# Altium schematic sheet OpenTag3_Sensors.SchDoc
size A
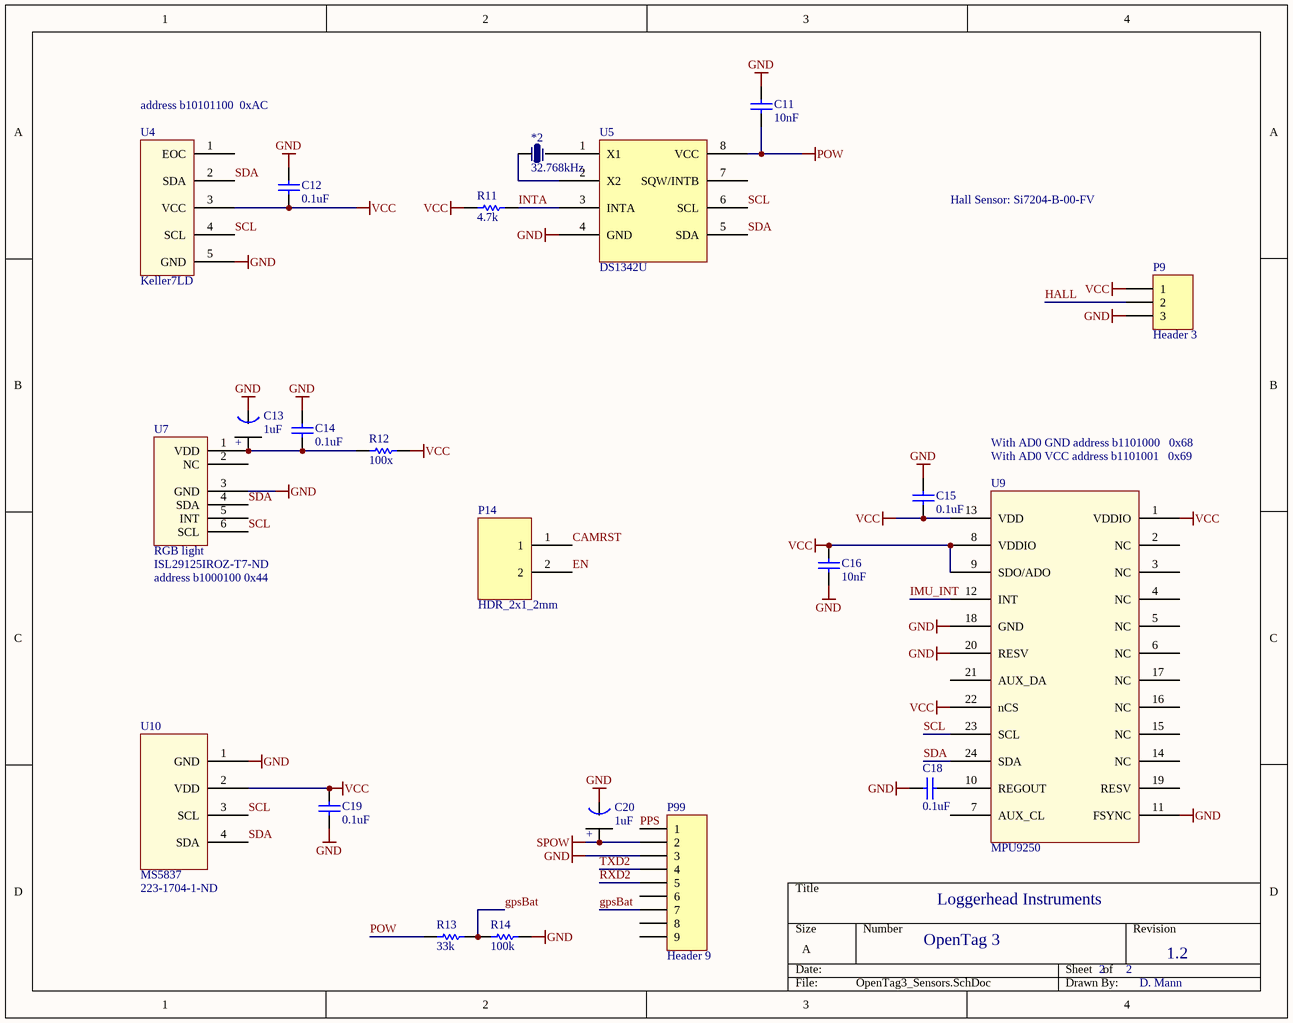
[diagram p0: OpenTag3_Sensors.SchDoc]

## Parts
*2  32.768kHz  [XTAL-ABS06]
C11  10nF  [0402]
C12  0.1uF  [0402]
C13  1uF  [Tant0805]
C14  0.1uF  [0402]
C15  0.1uF  [0402]
C16  10nF  [0402]
C18  0.1uF  [0402]
C19  0.1uF  [0402]
C20  1uF  [Tant0805]
P9  Header 3  [HDR1X3]
P14  HDR_2x1_2mm  [HDR_2x1_2mm]
P99  Header 9  [HDR1X9]
R11  4.7k  [3-0603]
R12  100x  [3-0603]
R13  33k  [3-0603]
R14  100k  [3-0603]
U4  Keller7LD  [Keller7LD]
U5  DS1342U  [uSOP8]
U7  RGB light  Supplier Part Number 1: ISL29125IROZ-T7-ND  [ODFN]
U9  MPU9250  [MPU6500]
U10  MS5837  Supplier Part Number 1: 223-1704-1-ND  [MS5837]

## Nets
GND: C11.1 C12.2 C13.1(GND) C14.2 C15.2 C16.2 C18.1 C19.1 C20.1(GND) P9.3 P99.3 R14.1 U4.5(GND) U5.4(GND) U7.3(GND) U9.11(FSYNC) U9.18(GND) U9.20(RESV) U10.1(GND)
POW: C11.2 R13.2 U5.8(VCC)
SPOW: C20.2(+) P99.2
VCC: C12.1 C15.1 C16.1 C19.2 P9.1 R11.1 R12.1 U4.3(VCC) U9.1(VDDIO) U9.8(VDDIO) U9.9(SDO/ADO) U9.13(VDD) U9.22(nCS) U10.2(VDD)
CAMRST: P14.1
EN: P14.2
gpsBat: P99.7 R13.1 R14.2
HALL: P9.2
IMU_INT: U9.12(INT)
INTA: R11.2 U5.3(INTA)
PPS: P99.1
RXD2: P99.5
SCL: U4.4(SCL) U5.6(SCL) U7.6(SCL) U9.23(SCL) U10.3(SCL)
SDA: U4.2(SDA) U5.5(SDA) U7.4(SDA) U9.24(SDA) U10.4(SDA)
TXD2: P99.4
Net*2_1: *2.1 U5.2(X2)
Net*2_2: *2.2 U5.1(X1)
NetC13_2: C13.2(+) C14.1 R12.2 U7.1(VDD)
NetC18_2: C18.2 U9.10(REGOUT)

Not connected (* = marked no-connect by the designer): P99 6 8 9; U4 1(EOC); U5 7(SQW/INTB); U7 2(NC) 5(INT); U9 2(NC) 3(NC) 4(NC) 5(NC) 6(NC) 7(AUX_CL) 14(NC) 15(NC) 16(NC) 17(NC) 19(RESV) 21(AUX_DA)

## Notes on the sheet
- (near U4) address b10101100  0xAC
- Hall Sensor: Si7204-B-00-FV
- With AD0 GND address b1101000   0x68
- With AD0 VCC address b1101001   0x69
- (near U7) address b1000100 0x44
- Loggerhead Instruments
- OpenTag 3
- 2
- 1.2
- D. Mann

## Library data of the parts
*2 = XTAL_ABS06
C11 C12 C14-C16 C18 C19 = C0402: Ceramic Chip Capacitor - Standard; Note: Footprint corresponds to dimensions for bulk cassette packaging. This case size has tightened tolerances.; Published: 17-Jul-2002; LatestRevisionDate: 19-Mar-2004; LatestRevisionNote: Silkscreen size reduced.; DatasheetDocument: Mar-2001; PackageDocument: Mar-2001; PackageReference: 0402; Publisher: Altium Limited; Code_JEITA: 0402; Code_IPC: 1005 [0402]; ComponentLink1Description: Manufacturer Link; ComponentLink1URL: http://www.kemet.com/; ComponentLink2Description: Datasheet; ComponentLink2URL: http://www.kemet.com/kemet/web/homepage/kechome.nsf/vapubfilesname/F3102TA.pdf/$file/F3102TA.pdf
  C11 C16: Value: 10nF
  C12 C14 C15 C18 C19: Value: 0.1uF
C13 C20 = Tant0805: Value: 1uF
P9 = Header 3: Header, 3-Pin; LatestRevisionDate: 17-Jul-2002; LatestRevisionNote: Re-released for DXP Platform.; Publisher: Altium Limited
P99 = Header 9: Header, 9-Pin; LatestRevisionDate: 17-Jul-2002; LatestRevisionNote: Re-released for DXP Platform.; Publisher: Altium Limited
R11-R14 = ERJ3RK: Precision Thick Film Chip Resistor, 10 Ohm to 1M Ohm Range, 1% and 0.5% Tolerance, 0603 Size, 0.063 W; Published: 17-Dec-2003; LatestRevisionDate: 19-Mar-2004; LatestRevisionNote: Silkscreen size reduced.; PackageDocument: Mar-2003; PackageReference: 3-0603; Publisher: Altium Limited; Code_IPC: 1608 [0603]; ComponentLink1Description: Manufacturer Link; ComponentLink1URL: http://www.panasonic.com/industrial/components/resistive_products.htm; ComponentLink2Description: Datasheet; ComponentLink2URL: http://www.panasonic.com/industrial/components/pdf/AOA0000CE2.pdf
U4 = Keller 7LD: Keller Pressure/Temp; PDF: http://www.kelleramerica.com/pdf-library/Piezoresistive%20OEM%20Pressure%20Transmitters%20with%20I2C%20interface%20and%20embedded%20signal%20conditioning.pdf
U5 = DS1337
U7 = ISL29125: RGB light sensor; Supplier 1: Digi-Key
U9 = MPU-9250: Invensense
U10 = MS5837: Pressure/Temp; Supplier 1: Digi-Key